# Altium schematic sheet Sheet2.SchDoc: VISB
size 420 x 297 mm; ApprovedBy: PBaizan; CheckedBy: PBaizan; Author: PBaizan; CompanyName: IONOSENS; DrawnBy: PBaizan; Engineer: PBaizan; Organization: IONOSENS; DocumentNumber: 20210001001SCH; Revision: 01; SheetNumber: 02; SheetTotal: 03; SubTitle: VISIR Instrument Supply Board (Relays); CAGE_CODE: 0001-21; SCH_SCALE: None; DOC_NO_SCH_DWG: 210001001SCH
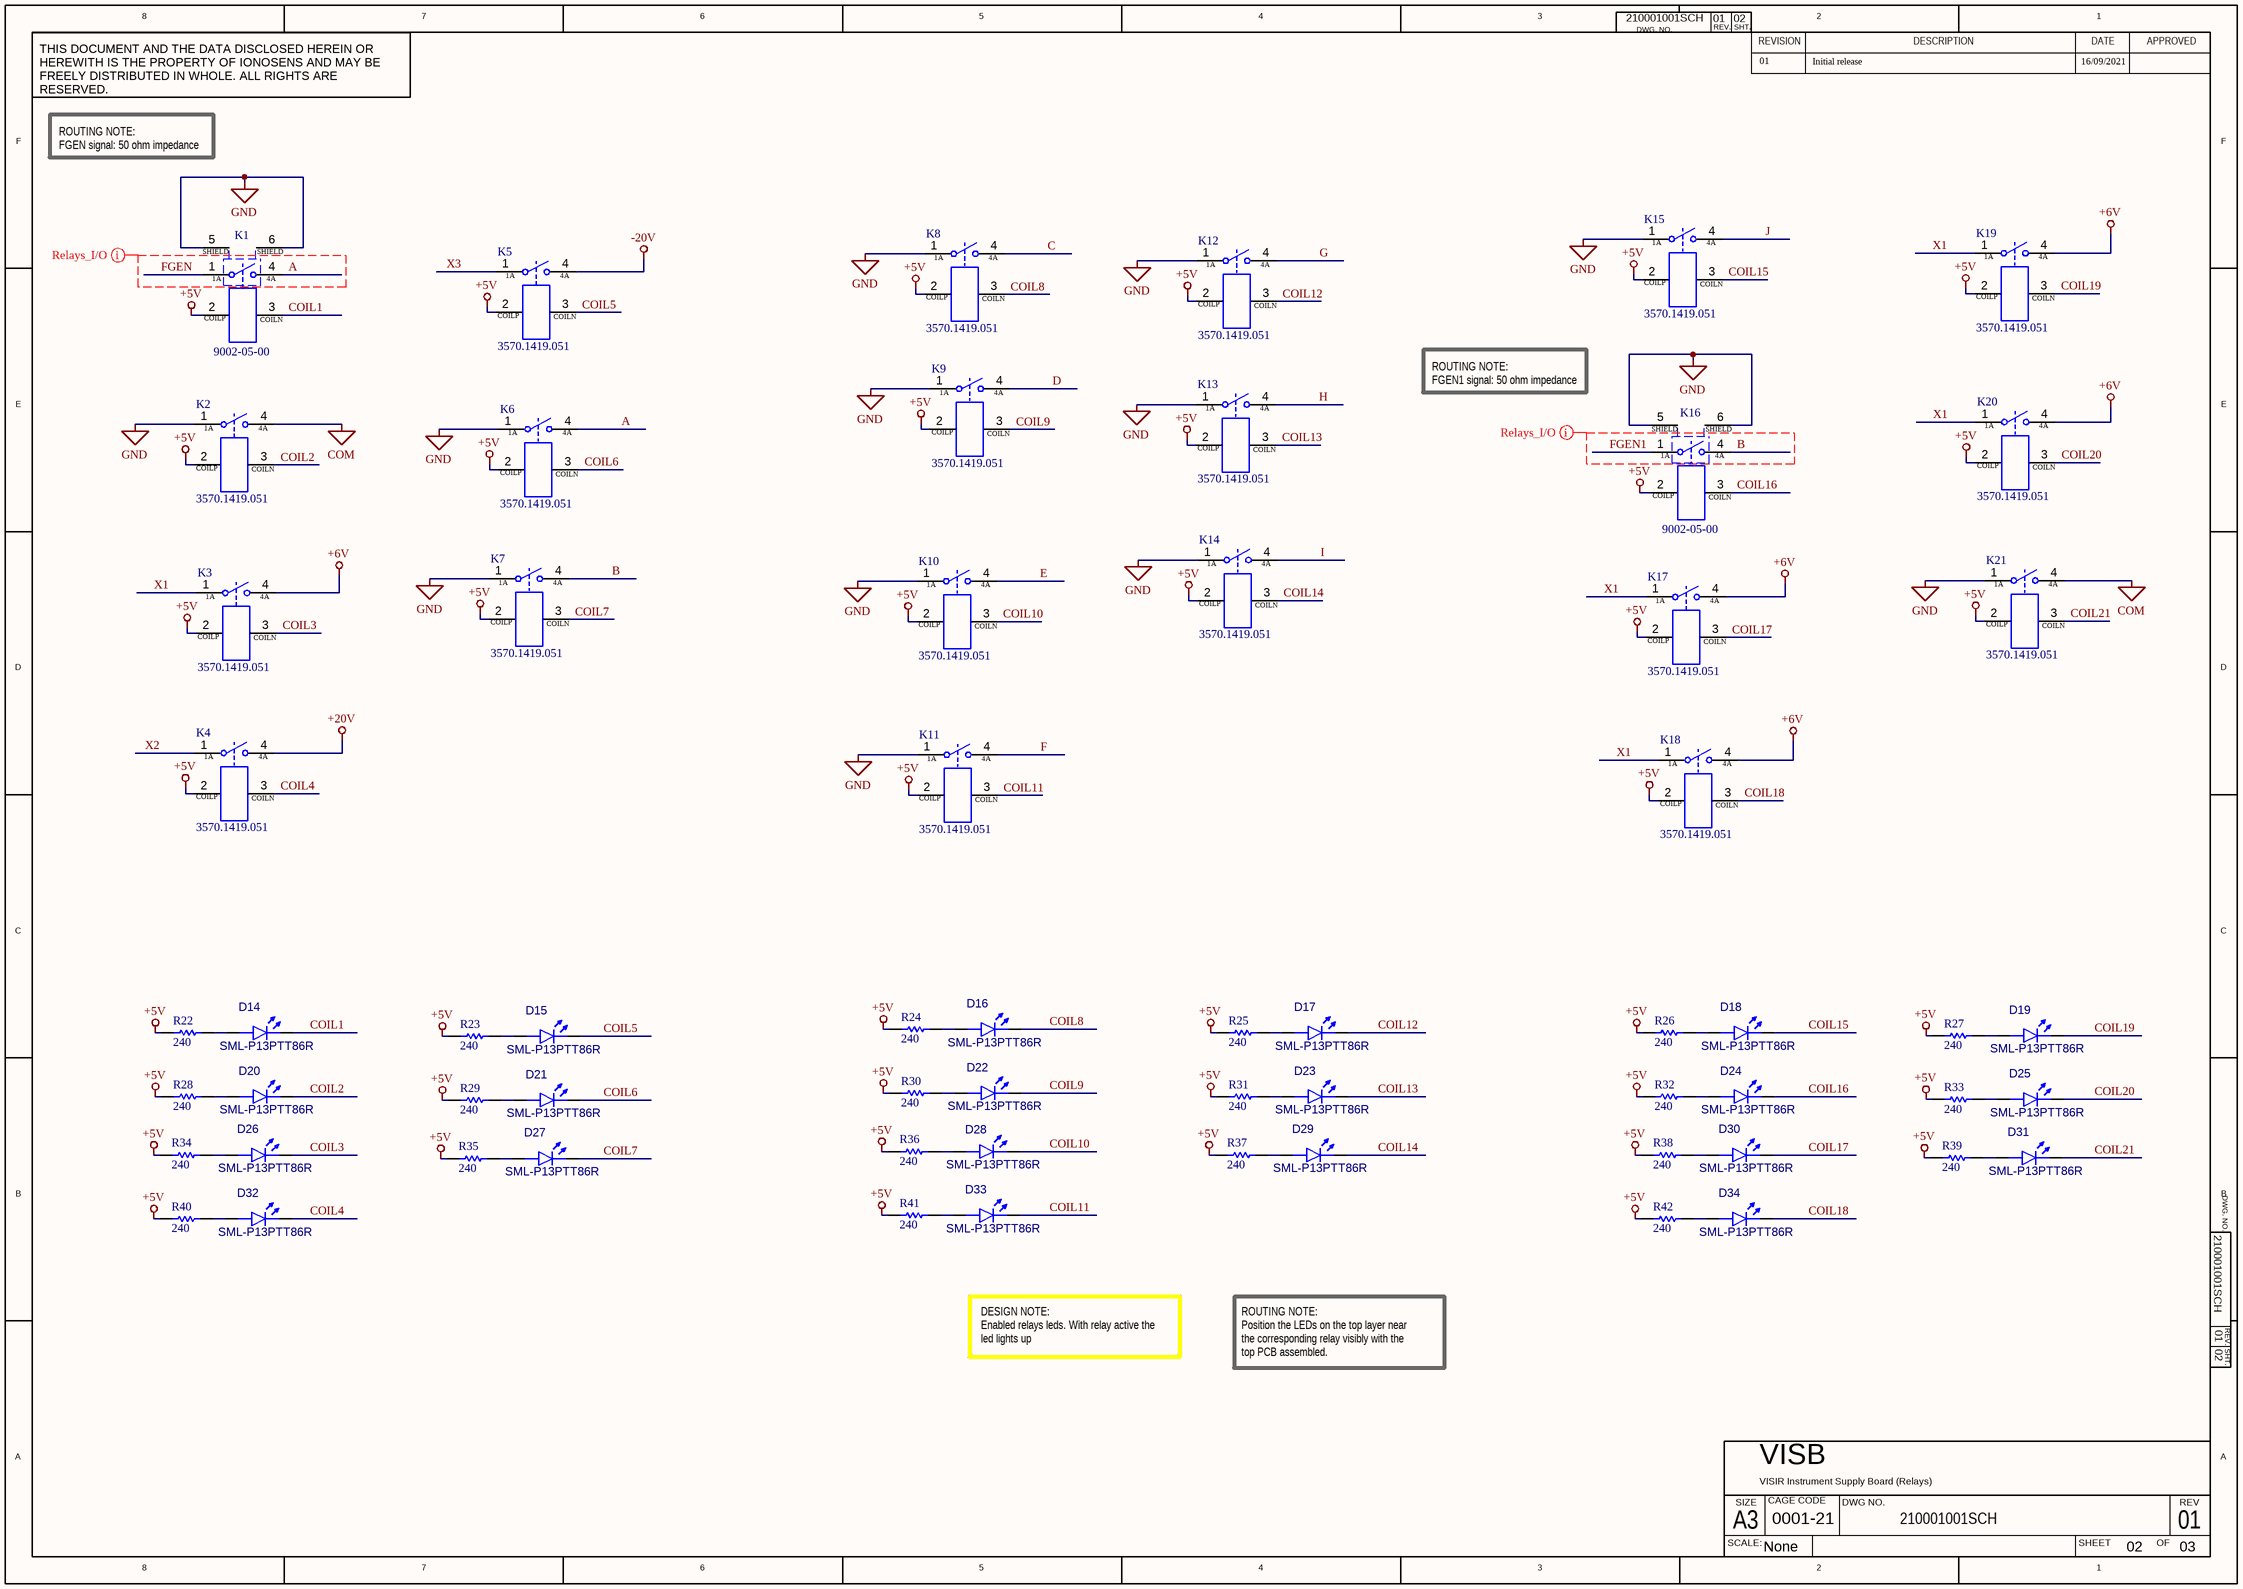
[diagram p0: Sheet2.SchDoc]

## Parts
D14  SML-P13PTT86R  [DIOC1005X02R]
D15  SML-P13PTT86R  [DIOC1005X02R]
D16  SML-P13PTT86R  [DIOC1005X02R]
D17  SML-P13PTT86R  [DIOC1005X02R]
D18  SML-P13PTT86R  [DIOC1005X02R]
D19  SML-P13PTT86R  [DIOC1005X02R]
D20  SML-P13PTT86R  [DIOC1005X02R]
D21  SML-P13PTT86R  [DIOC1005X02R]
D22  SML-P13PTT86R  [DIOC1005X02R]
D23  SML-P13PTT86R  [DIOC1005X02R]
D24  SML-P13PTT86R  [DIOC1005X02R]
D25  SML-P13PTT86R  [DIOC1005X02R]
D26  SML-P13PTT86R  [DIOC1005X02R]
D27  SML-P13PTT86R  [DIOC1005X02R]
D28  SML-P13PTT86R  [DIOC1005X02R]
D29  SML-P13PTT86R  [DIOC1005X02R]
D30  SML-P13PTT86R  [DIOC1005X02R]
D31  SML-P13PTT86R  [DIOC1005X02R]
D32  SML-P13PTT86R  [DIOC1005X02R]
D33  SML-P13PTT86R  [DIOC1005X02R]
D34  SML-P13PTT86R  [DIOC1005X02R]
K1  9002-05-00  [SIP564W40P254L1980H810Q6 - Cloned]
K2  3570.1419.051  [3570.1419]
K3  3570.1419.051  [3570.1419]
K4  3570.1419.051  [3570.1419]
K5  3570.1419.051  [3570.1419]
K6  3570.1419.051  [3570.1419]
K7  3570.1419.051  [3570.1419]
K8  3570.1419.051  [3570.1419]
K9  3570.1419.051  [3570.1419]
K10  3570.1419.051  [3570.1419]
K11  3570.1419.051  [3570.1419]
K12  3570.1419.051  [3570.1419]
K13  3570.1419.051  [3570.1419]
K14  3570.1419.051  [3570.1419]
K15  3570.1419.051  [3570.1419]
K16  9002-05-00  [SIP564W40P254L1980H810Q6 - Cloned]
K17  3570.1419.051  [3570.1419]
K18  3570.1419.051  [3570.1419]
K19  3570.1419.051  [3570.1419]
K20  3570.1419.051  [3570.1419]
K21  3570.1419.051  [3570.1419]
R22  value 240  [RESC1005X04M]  (hidden comment: AC0402FR-07240RL)
R23  value 240  [RESC1005X04M]  (hidden comment: AC0402FR-07240RL)
R24  value 240  [RESC1005X04M]  (hidden comment: AC0402FR-07240RL)
R25  value 240  [RESC1005X04M]  (hidden comment: AC0402FR-07240RL)
R26  value 240  [RESC1005X04M]  (hidden comment: AC0402FR-07240RL)
R27  value 240  [RESC1005X04M]  (hidden comment: AC0402FR-07240RL)
R28  value 240  [RESC1005X04M]  (hidden comment: AC0402FR-07240RL)
R29  value 240  [RESC1005X04M]  (hidden comment: AC0402FR-07240RL)
R30  value 240  [RESC1005X04M]  (hidden comment: AC0402FR-07240RL)
R31  value 240  [RESC1005X04M]  (hidden comment: AC0402FR-07240RL)
R32  value 240  [RESC1005X04M]  (hidden comment: AC0402FR-07240RL)
R33  value 240  [RESC1005X04M]  (hidden comment: AC0402FR-07240RL)
R34  value 240  [RESC1005X04M]  (hidden comment: AC0402FR-07240RL)
R35  value 240  [RESC1005X04M]  (hidden comment: AC0402FR-07240RL)
R36  value 240  [RESC1005X04M]  (hidden comment: AC0402FR-07240RL)
R37  value 240  [RESC1005X04M]  (hidden comment: AC0402FR-07240RL)
R38  value 240  [RESC1005X04M]  (hidden comment: AC0402FR-07240RL)
R39  value 240  [RESC1005X04M]  (hidden comment: AC0402FR-07240RL)
R40  value 240  [RESC1005X04M]  (hidden comment: AC0402FR-07240RL)
R41  value 240  [RESC1005X04M]  (hidden comment: AC0402FR-07240RL)
R42  value 240  [RESC1005X04M]  (hidden comment: AC0402FR-07240RL)

## Nets
+5V: K1.2(COILP) K2.2(COILP) K3.2(COILP) K4.2(COILP) K5.2(COILP) K6.2(COILP) K7.2(COILP) K8.2(COILP) K9.2(COILP) K10.2(COILP) K11.2(COILP) K12.2(COILP) K13.2(COILP) K14.2(COILP) K15.2(COILP) K16.2(COILP) K17.2(COILP) K18.2(COILP) K19.2(COILP) K20.2(COILP) K21.2(COILP) R22.1 R23.1 R24.1 R25.1 R26.1 R27.1 R28.1 R29.1 R30.1 R31.1 R32.1 R33.1 R34.1 R35.1 R36.1 R37.1 R38.1 R39.1 R40.1 R41.1 R42.1
+6V: K3.4(4A) K17.4(4A) K18.4(4A) K19.4(4A) K20.4(4A)
+20V: K4.4(4A)
-20V: K5.4(4A)
COM: K2.4(4A) K21.4(4A)
GND: K1.5(Shield) K1.6(Shield) K2.1(1A) K6.1(1A) K7.1(1A) K8.1(1A) K9.1(1A) K10.1(1A) K11.1(1A) K12.1(1A) K13.1(1A) K14.1(1A) K15.1(1A) K16.5(Shield) K16.6(Shield) K21.1(1A)
A: K1.4(4A) K6.4(4A)
B: K7.4(4A) K16.4(4A)
C: K8.4(4A)
COIL1: D14.1(K) K1.3(COILN)
COIL2: D20.1(K) K2.3(COILN)
COIL3: D26.1(K) K3.3(COILN)
COIL4: D32.1(K) K4.3(COILN)
COIL5: D15.1(K) K5.3(COILN)
COIL6: D21.1(K) K6.3(COILN)
COIL7: D27.1(K) K7.3(COILN)
COIL8: D16.1(K) K8.3(COILN)
COIL9: D22.1(K) K9.3(COILN)
COIL10: D28.1(K) K10.3(COILN)
COIL11: D33.1(K) K11.3(COILN)
COIL12: D17.1(K) K12.3(COILN)
COIL13: D23.1(K) K13.3(COILN)
COIL14: D29.1(K) K14.3(COILN)
COIL15: D18.1(K) K15.3(COILN)
COIL16: D24.1(K) K16.3(COILN)
COIL17: D30.1(K) K17.3(COILN)
COIL18: D34.1(K) K18.3(COILN)
COIL19: D19.1(K) K19.3(COILN)
COIL20: D25.1(K) K20.3(COILN)
COIL21: D31.1(K) K21.3(COILN)
D: K9.4(4A)
E: K10.4(4A)
F: K11.4(4A)
FGEN: K1.1(1A)
FGEN1: K16.1(1A)
G: K12.4(4A)
H: K13.4(4A)
I: K14.4(4A)
J: K15.4(4A)
X1: K3.1(1A) K17.1(1A) K18.1(1A) K19.1(1A) K20.1(1A)
X2: K4.1(1A)
X3: K5.1(1A)
NetD14_2: D14.2(A) R22.2
NetD15_2: D15.2(A) R23.2
NetD16_2: D16.2(A) R24.2
NetD17_2: D17.2(A) R25.2
NetD18_2: D18.2(A) R26.2
NetD19_2: D19.2(A) R27.2
NetD20_2: D20.2(A) R28.2
NetD21_2: D21.2(A) R29.2
NetD22_2: D22.2(A) R30.2
NetD23_2: D23.2(A) R31.2
NetD24_2: D24.2(A) R32.2
NetD25_2: D25.2(A) R33.2
NetD26_2: D26.2(A) R34.2
NetD27_2: D27.2(A) R35.2
NetD28_2: D28.2(A) R36.2
NetD29_2: D29.2(A) R37.2
NetD30_2: D30.2(A) R38.2
NetD31_2: D31.2(A) R39.2
NetD32_2: D32.2(A) R40.2
NetD33_2: D33.2(A) R41.2
NetD34_2: D34.2(A) R42.2

## Layout directives
net class Relays_I/O: A, B, FGEN, FGEN1

## Notes on the sheet
- 01
- Initial release
- 16/09/2021
- ROUTING NOTE:
  FGEN signal: 50 ohm impedance
- ROUTING NOTE:
  FGEN1 signal: 50 ohm impedance
- DESIGN NOTE:
  Enabled relays leds. With relay active the led lights up
- ROUTING NOTE:
  Position the LEDs on the top layer near the corresponding relay visibly with the top PCB assembled.
- 8
- 7
- 6
- 5
- 4
- 3
- DWG. NO.
- REV.
- SHT.
- REVISION
- 2
- DESCRIPTION
- DATE
- 1
- APPROVED
- THIS DOCUMENT AND THE DATA DISCLOSED HEREIN OR HEREWITH IS THE PROPERTY OF IONOSENS AND MAY BE FREELY DISTRIBUTED IN WHOLE. ALL RIGHTS ARE RESERVED.
- F
- E
- D
- C
- B
- A
- SCALE:
- A3
- SIZE
- CAGE CODE
- DWG NO.
- SHEET
- OF
- REV
- (in symbol K01-0008-01-00002-6) SHIELD

## Library data of the parts
D14-D34 = D01-0402-01-00000-1: Led green 0402; Manufacturer: ROHM; Forward Voltage: 2.1V; Max Power Dissipation: 52mW; Forward Current: 20 mA; Number of LEDs: 1; Dominant Wavelength: 560 nm; Luminous Intensity: 10 mcd; Lens Style: Rectangular, Square; Min Operating Temperature: -40°C; Mounting Technology: SMD; Colour: Green; Manufacturer P/N: SML-P13PTT86R; Max Operating Temperature: 85°C; Pins: 2; RoHS Compliant: Yes; Case/Package: 0402
K1 K16 = K01-0008-01-00002-6: Reed Relay 5VDC 350Ohm 0.5A SPST-NO THT; Manufacturer: COTO; Rise time: 350µs; Coil Current: 14.28mA; Release Time: 100µs; Number of Terminal: 6; Contact Form: SPST; Insulation Resistance: 1T; Coil Type: Non-Latching; Coil Voltage (DC): 5V; Contact Current Rating: 500mA; Contact Resistence: 0.2; Switching Voltage: 200V; Coil resitence: 350; Relay Type: RF; Mounting Technology: Through Hole; Case/Package: SIP; Contact Material: Ruthenium; Packaging: Bulk; Width: 19.3mm; Height: 7.6mm; Max Operating Temperature: 85°C; RoHS: Yes; Min Operating Temperature: -20°C; Pins: 6; Switching Current: 500mA; Operate Time: 350µs; Manufacturer P/N: 9002-05-00
K2-K15 K17-K21 = K01-0008-01-00008-1: Reed Relay, Mini SIP, 5 VDC; 1 Form A, 15W, 200 VDC, 1.25A; Manufacturer: Comus; Number of Terminal: 4; Contact Current Rating: 1A; Coil Current: 10mA; Switching Voltage: 200V; Rise time: 0s; Contact Resistence: 0.15; Coil resitence: 500; Operate Time: 350µs; Coil Voltage (DC): 5V; Insulation Resistance: 0; Release Time: 100µs; Manufacturer P/N: 3570.1419.051; Mounting Technology: TH; Contact Material: -; Relay Type: Reed; Width: 15.24mm; Contact Form: 1A; Packaging: SIP; Switching Current: 1A; Pins: 4; Case/Package: SIP; Coil Type: -; Min Operating Temperature: -40°C; RoHS: Yes; Height: 6.98mm; Max Operating Temperature: 85°C
R22-R42 = R01-0402-01-00437-2: RES SMD 240 OHM 1% 1/16W 0402; Manufacturer: Yageo; Temperature Coefficient: 100 ppm/ºC; Power Rating: 62.5mW; Voltage Rating: 50V; Packaging: Tape & Reel; Manufacturer P/N: AC0402FR-07240RL; Height: 370µm; Case/Package: 0402; Composition: Thick Film; Max Operating Temperature: 155°C; Number of Terminations: 2; RoHS: Yes; Min Operating Temperature: -55°C; Tolerance: 1%; Width: 508µm; Length: 990.6µm; Features: Automotive AEC-Q200, Moisture Resistant